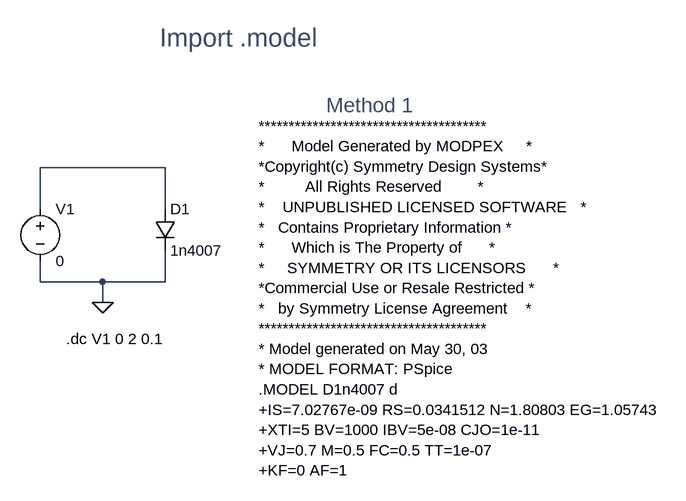
[diagram p0: schematic LTspice 06-1 Import SPICE model_method1 model format Pspice.asc]
LTspice 06-1 Import SPICE model_method1 model format Pspice.asc, the LTspice schematic file:
Version 4
SHEET 1 2548 680
WIRE 304 -208 112 -208
WIRE 112 -144 112 -208
WIRE 304 -144 304 -208
WIRE 112 -32 112 -64
WIRE 208 -32 112 -32
WIRE 304 -32 304 -80
WIRE 304 -32 208 -32
WIRE 208 0 208 -32
FLAG 208 0 0
SYMBOL voltage 112 -160 R0
SYMATTR InstName V1
SYMATTR Value 0
SYMBOL diode 288 -144 R0
SYMATTR InstName D1
SYMATTR Value 1n4007
TEXT 296 -408 Left 4 ;Import .model
TEXT 448 -272 Left 2 !**************************************\n*      Model Generated by MODPEX     *\n*Copyright(c) Symmetry Design Systems*\n*         All Rights Reserved        *\n*    UNPUBLISHED LICENSED SOFTWARE   *\n*   Contains Proprietary Information *\n*      Which is The Property of      *\n*     SYMMETRY OR ITS LICENSORS      *\n*Commercial Use or Resale Restricted *\n*   by Symmetry License Agreement    *\n**************************************\n* Model generated on May 30, 03\n* MODEL FORMAT: PSpice\n.MODEL D1n4007 d\n+IS=7.02767e-09 RS=0.0341512 N=1.80803 EG=1.05743\n+XTI=5 BV=1000 IBV=5e-08 CJO=1e-11\n+VJ=0.7 M=0.5 FC=0.5 TT=1e-07\n+KF=0 AF=1
TEXT 152 56 Left 2 !.dc V1 0 2 0.1
TEXT 552 -304 Left 3 ;Method 1

The netlist it stands for:
* LTspice 06-1 Import SPICE model_method1 model format Pspice.asc
V1 N001 0 0
D1 N001 0 1n4007
.model D D
.lib standard.dio
* Import .model
**************************************
*      Model Generated by MODPEX     *
*Copyright(c) Symmetry Design Systems*
*         All Rights Reserved        *
*    UNPUBLISHED LICENSED SOFTWARE   *
*   Contains Proprietary Information *
*      Which is The Property of      *
*     SYMMETRY OR ITS LICENSORS      *
*Commercial Use or Resale Restricted *
*   by Symmetry License Agreement    *
**************************************
* Model generated on May 30, 03
* MODEL FORMAT: PSpice
.MODEL D1n4007 d
+IS=7.02767e-09 RS=0.0341512 N=1.80803 EG=1.05743
+XTI=5 BV=1000 IBV=5e-08 CJO=1e-11
+VJ=0.7 M=0.5 FC=0.5 TT=1e-07
+KF=0 AF=1
.dc V1 0 2 0.1
* Method 1
.backanno
.end